# EAGLE design HV Board r2 (EAGLE 7.2.0)
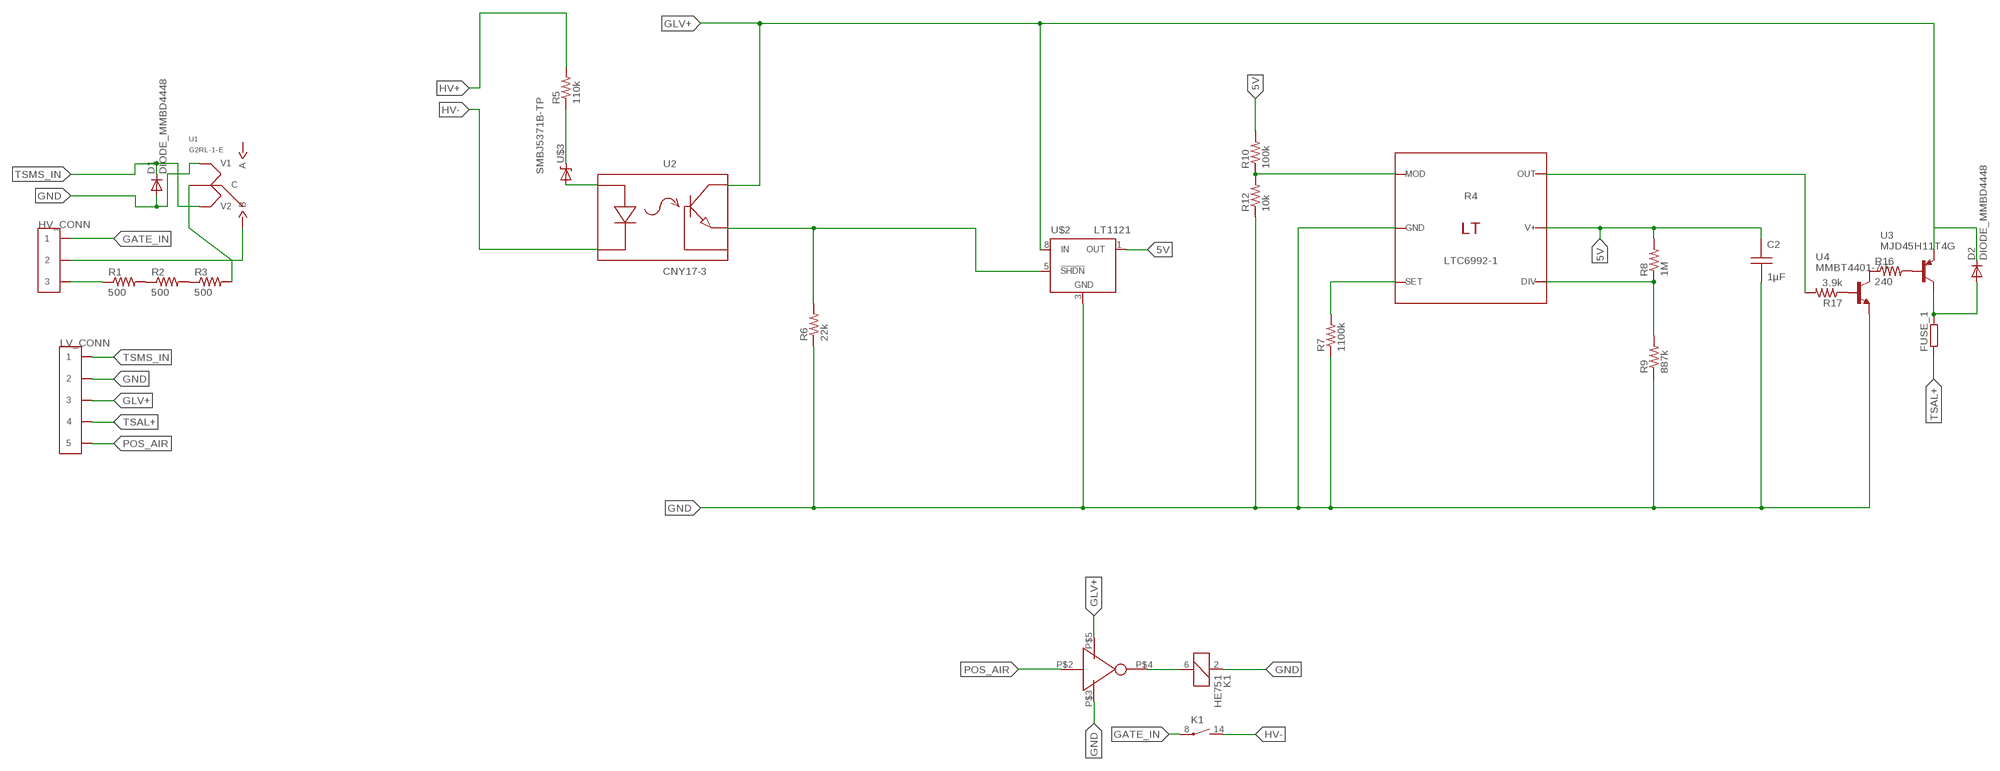
[diagram p0: schematic, sheet 1]

## Parts
C2  1µF  CAP  [C0805]
D1  DIODE_MMBD4448  [SOT-23-3]
D2  DIODE_MMBD4448  [SOT-23-3]
FUSE_1  R-EU_R0402  [R0402]
HV_CONN  CONN_3  [CONNECTOR_3]
K1  HE751  [HE751]
LV_CONN  CONN_5  [CONNECTOR_5]
R1  500  FS20SERIES  [VISHAY_FS20W_RES]
R2  500  FS20SERIES  [VISHAY_FS20W_RES]
R3  500  FS20SERIES  [VISHAY_FS20W_RES]
R4  LTC6992-1  [LTC6992-1]
R5  110k  RESISTORPTH-1W  [AXIAL-0.6]
R6  22k  RESISTOR0603-RES  [0603-RES]
R7  1100k  RESISTOR0603-RES  [0603-RES]
R8  1M  RESISTOR0603-RES  [0603-RES]
R9  887k  RESISTOR0603-RES  [0603-RES]
R10  100k  RESISTOR0603-RES  [0603-RES]
R12  10k  RESISTOR0603-RES  [0603-RES]
R16  240  RESISTORPTH-1W  [AXIAL-0.6]
R17  3.9k  R-US_R0402  [R0402]
U1  G2RL-1-E  [G2RL-1-E_RELAY]
U2  CNY17-3  [CNY17-3]
U3  MJD45H11T4G  [D-PAK_TO252AA]
U4  MMBT4401-7-F  [SOT-23-3]
U$1  TC4S69F(TE85L,F)  [SSOP5-P-0.95]
U$2  LT1121  [SOIC8]
U$3  SMBJ5371B-TP  [SMB-DIODE]

## Nets
5V: C2.1(A) R4.P$5(V+) R8.2 R10.2 U$2.1(OUT)
GATE_IN: HV_CONN.1 HV_CONN.2 K1.8(2:P)
GLV+: D2.P$1(C) LV_CONN.5 LV_CONN.6 U2.P$5(C) U3.3(E) U$1.P$5(VCC) U$2.8(IN)
GND: C2.2(B) D1.P$2(A) K1.2 LV_CONN.3 LV_CONN.4 R4.P$2(GND) R6.1 R7.1 R9.1 R12.1 U1.P$1(V1) U4.P$3(E) U$1.P$3(GND) U$2.3(GND)
HV+: HV_CONN.3 HV_CONN.4 R5.P$2 U1.P$2(B) U1.P$7(B)
HV-: HV_CONN.5 HV_CONN.6 K1.14(2:S) R1.P$1 U2.P$1(K)
N$1: R5.P$1 U$3.C
N$2: K1.6 U$1.P$4(OUT)
N$3: R3.P$2 U1.P$3(C) U1.P$6(C)
N$10: R1.P$2 R2.P$1
N$11: R2.P$2 R3.P$1
N$14: R4.P$1(MOD) R10.1 R12.2
N$15: U2.P$2(A) U$3.A
N$17: R16.P$2 U3.1(B)
N$18: R4.P$3(SET) R7.2
N$19: R4.P$4(DIV) R8.1 R9.2
N$20: R16.P$1 U4.P$1(C)
N$21: R17.1 U4.P$2(B)
N$22: R4.P$6(OUT) R17.2
N$26: R6.2 U2.P$4(E) U$2.5(!SHDN)
N$29: D2.P$2(A) FUSE_1.2 U3.4(C)
POS_AIR: LV_CONN.9 LV_CONN.10 U$1.P$2(IN)
TSAL+: FUSE_1.1 LV_CONN.7 LV_CONN.8
TSMS_IN: D1.P$1(C) LV_CONN.1 LV_CONN.2 U1.P$8(V2)
Unconnected: U1.P$4(A) U1.P$5(A) U2.P$6(B)

## Library data of the parts
C2 = sym:CAP: Capacitor
D1 D2 = formula electric:DIODE_MMBD4448
FUSE_1 = resistor:R-EU_: RESISTOR, European symbol
HV_CONN = formula electric:CONN_3
K1 = relay:HE751: RELAY reed, 1 x norm. open, Hamlin; OC_FARNELL: unknown; OC_NEWARK: unknown
LV_CONN = formula electric:CONN_5
R1-R3 = formula electric:FS20SERIES: Digikey FS20-{R}
R4 = FE_Kenny:LTC6992-1
R5-R10 R12 R16 = SparkFun-Resistors:RESISTOR: Resistor Basic schematic elements and footprints for 0603, 1206, and PTH resistors.
R17 = resistor:R-US_: RESISTOR, American symbol
U1 = formula electric:G2RL-1-E: G2RL-1-E SPDT Relay, 16A, Digikey: Z2834-ND; COIL: DC 12
U2 = FE_Kenny:CNY17-3
U3 = on-semiconductor:MJD45H11T4G
U4 = formula electric:MMBT4401-7-F
U$1 = formula electric:TC4S69F(TE85L,F)
U$2 = linear-technology:LT1121
U$3 = micro-commercial:SMBJ5371B-TP

## Board
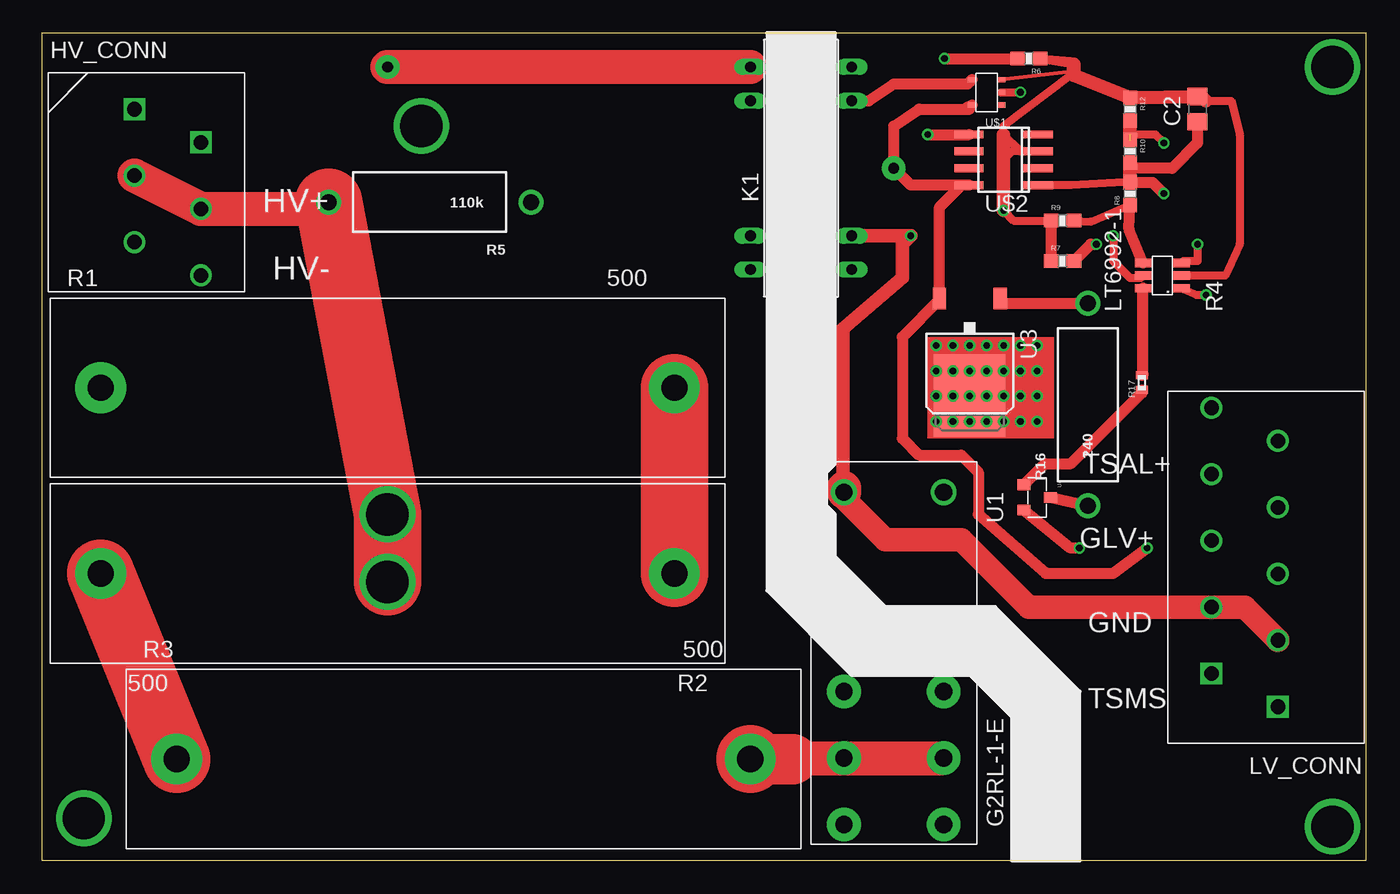
[diagram p1: board, top side]
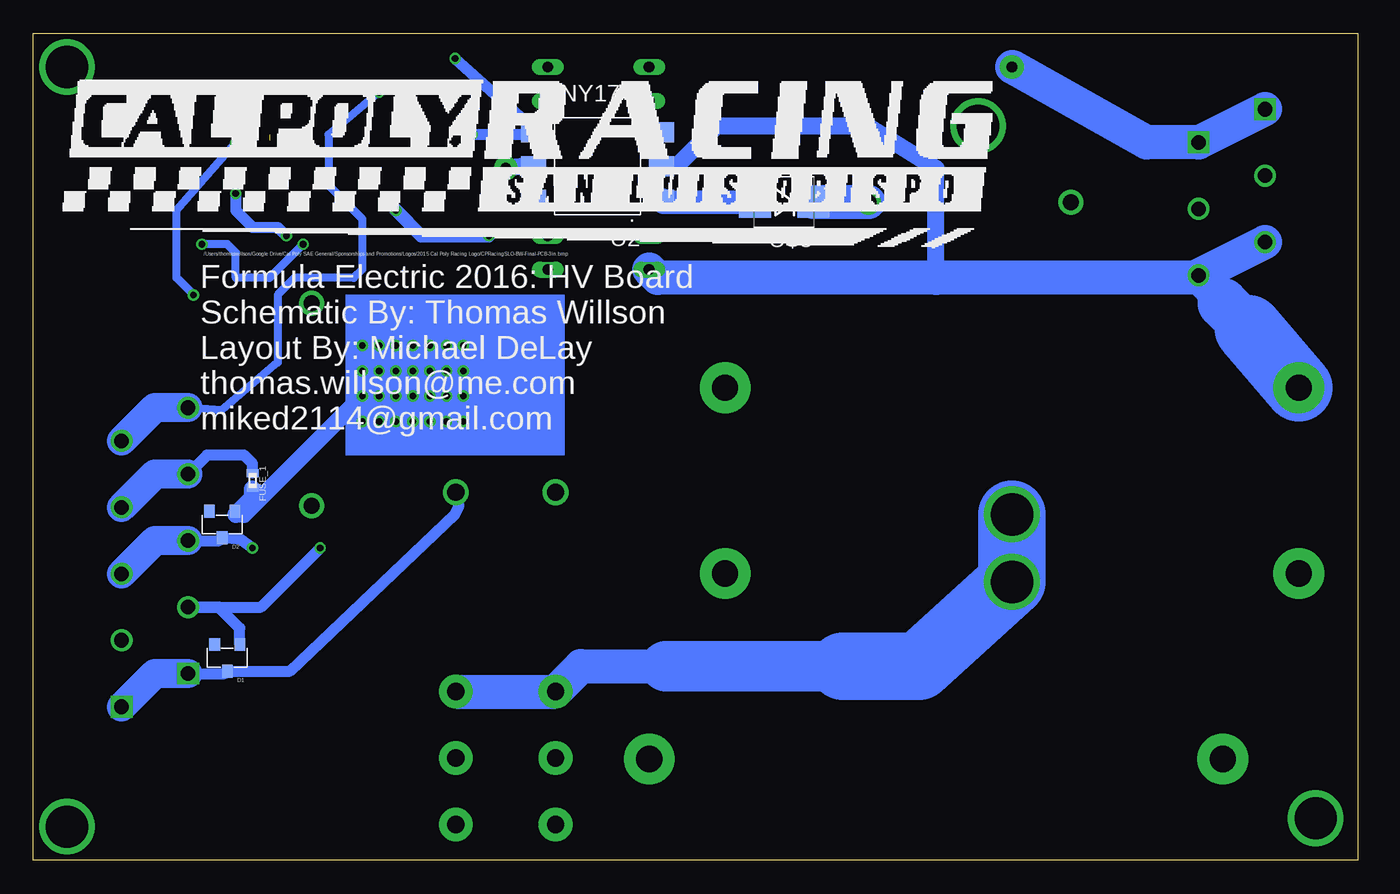
[diagram p2: board, bottom side, seen from below]

Size 99.69 x 62.23 mm. Coordinates in mm from the lower left corner, seen from the top.
Outline: 0,0 99.69,0 99.69,62.23 0,62.23 0,0
Copper layers (1*16): Top 0.0356mm / dielectric 1.5011mm / Bottom 0.0356mm
Design rules "LaenPCBOrder": minimum track width 6mil, minimum drill 13mil, track to track 6mil, track to pad 6mil, pad to pad 6mil, via to via 6mil, smd to smd 6mil, copper to edge 15mil, drill to drill 6mil, minimum pad ring 7mil, minimum via ring 7mil, stop-mask expansion 3mil, vias tented up to drill 0mil, thermal gap 10mil

### Footprints (pad centres in the part's own frame; a part is rotated, then mirrored left to right if it is on the bottom)
C0805 = smd 1.3 x 1.5: 1 -0.95,0; 2 0.95,0
SOT-23-3 = smd 0.8 x 0.976: P$1 0,1; P$2 -0.95,-1; P$3 0.95,-1
R0402 = smd 0.6 x 0.9: 1 -0.55,0; 2 0.55,0
CONNECTOR_3 = drill 1.1 square: 1 0,0; 2 2.5,5 | drill 1.1: 3 5,0; 4 7.5,5; 5 10,0; 6 12.5,5
HE751 = drill 0.813 long: 1 -7.62,-3.81; 2 -5.08,-3.81; 6 5.08,-3.81; 7 7.62,-3.81; 8 7.62,3.81; 9 5.08,3.81; 13 -5.08,3.81; 14 -7.62,3.81
CONNECTOR_5 = drill 1.1 square: 1 0,0; 2 2.5,5 | drill 1.1: 3 5,0; 4 7.5,5; 5 10,0; 6 12.5,5; 7 15,0; 8 17.5,5; 9 20,0; 10 22.5,5
VISHAY_FS20W_RES = drill 1.981 pad 3.81: P$1 -21.59,0; P$2 21.59,0
LTC6992-1 = smd 0.62 x 1.22: P$1 0.5,-0.7; P$2 1.45,-0.7; P$3 2.4,-0.7; P$4 2.4,2.2; P$5 1.45,2.2; P$6 0.5,2.2
AXIAL-0.6 = drill 1.2 pad 1.88: P$1 -7.62,0; P$2 7.62,0
0603-RES = smd 1.1 x 1: 1 -0.85,0; 2 0.85,0
G2RL-1-E_RELAY = drill 1.3: P$1 -15,-3.75; P$8 -15,3.75 | drill 1.3 pad 2.54: P$2 0,-3.75; P$3 5,-3.75; P$4 10,-3.75; P$5 10,3.75; P$6 5,3.75; P$7 0,3.75
CNY17-3 = smd 1.88 x 1.52: P$1 -1.55,3.65; P$2 -1.55,6.19; P$3 -1.55,1.11; P$4 8.05,1.11; P$5 8.05,3.65; P$6 8.05,6.19
D-PAK_TO252AA = smd 1 x 1.6: 1 -2.28,-4.8; 3 2.28,-4.8 | smd 5.4 x 6.2: 4 0,2.5
SSOP5-P-0.95 = smd 0.6 x 0.4: P$1 -1.1,0.95; P$2 -1.1,0; P$3 -1.1,-0.95; P$4 1.1,-0.95; P$5 1.1,0.95
SOIC8 = smd 0.6 x 2.2: 1 -1.905,-2.6; 2 -0.635,-2.6; 3 0.635,-2.6; 4 1.905,-2.6; 5 1.905,2.6; 6 0.635,2.6; 7 -0.635,2.6; 8 -1.905,2.6
SMB-DIODE = smd 2.4 x 2.4: A 2.2,0; C -2.2,0

### Placement (x,y rotation side)
C2  87,56.52 90 top
D1  85.09,15.24 180 bottom
D2  85.47,25.27 180 bottom
FUSE_1  83.19,28.57 270 bottom
HV_CONN  6.99,56.52 270 top
K1  57.15,52.07 90 top
LV_CONN  93.04,11.56 90 top
R1  26.04,35.56 0 top
R2  26.04,21.59 180 top
R3  31.75,7.62 0 top
R4  85.09,42.55 90 top
R5  29.21,49.53 180 top
R6  74.3,60.33 180 top
R7  76.83,45.09 0 top
R8  81.92,50.16 90 top
R9  76.83,48.13 0 top
R10  81.92,53.34 270 top
R12  81.92,56.52 270 top
R16  78.74,34.29 90 top
R17  82.8,35.94 90 top
U1  64.14,12.7 270 top
U2  53.98,55.88 180 bottom
U3  69.85,37.47 180 top
U4  74.93,27.3 270 top
U$1  71.12,57.78 180 top
U$2  72.39,52.7 90 top
U$3  43.18,49.53 180 bottom

### Tracks (layer width: path | path; a pad name or v marks a point on that pad's centre or on a via)
5V  (via drill 0.5)
  Top 0.61: R8.2 81.5,51.02 77.47,50.8 U$2.1 | v80.64,46.99 80.64,45.09 81.92,43.81 82.71,43.81 R4.P$5
  Top 0.813: C2.1 87,53.98 85.09,52.07 81.92,52.07 | R8.2 83.61,51.02 v84.45,50.16
  Top 1.016: R10.2 81.92,52.07 R8.2
  Bottom 0.813: v84.45,50.16 84.45,48.9 83.19,47.62 81.28,47.62 v80.64,46.99
GATE_IN  (via drill 0.8 pad 1.78)
  Top 2.54: v26.04,59.69 K1.8
  Bottom 2.54: HV_CONN.1 HV_CONN.2 15.91,54.02 v26.04,59.69
GLV+  (via drill 0.5, 0.8 pad 1.78)
  Top 0.813: U$1.P$5 69.68,56.69 69.85,56.52 66.04,56.52 64.14,55.24 v64.14,52.07 65.41,50.8 69.22,50.8 | U$2.8 69.22,50.8 | 69.22,50.8 67.57,49.16 U3.3 67.57,42.17 64.77,39.37 64.77,31.75 66.04,30.48 69.22,30.48 70.48,29.21 70.48,26.04 75.56,21.59 80.64,21.59 v83.19,23.5
  Bottom 0.813: LV_CONN.6 85.69,24.06 D2.P$1 84.06,24.13 v83.19,23.5
  Bottom 1.27: U2.P$5 62.7,52.23 v64.14,52.07
  Bottom 2.184: LV_CONN.6 90.54,24.06 LV_CONN.5
GND  (via drill 0.5)
  Top 0.305: 77.47,59.05 77.78,59.37 U$1.P$3
  Top 0.61: 77.47,59.05 72.39,55.24 72.39,54.61 73.66,53.34 U$2.3 73.03,53.34 72.39,52.7 v72.39,48.9 73.15,48.13 R9.1 | 77.47,59.05 77.47,60.11 R6.1 77.69,59.91 77.47,59.05 | 87.63,57.15 89.53,57.15 90.17,54.61 90.17,46.35 89.08,43.99 R4.P$2
  Top 0.813: R7.1 R9.1 | v78.11,23.5 77.42,23.5 U4.P$3
  Top 1.016: 72.39,54.61 v72.39,48.9 | K1.2 v65.41,46.99 64.77,46.35 64.77,43.81 60.33,40.01 60.33,27.94 | 77.69,59.91 77.69,59.05 R12.1 C2.2 87.31,57.47 87.63,57.15
  Top 1.778: U1.P$1 60.38,27.25 63.5,24.13 69.22,24.13 74.3,19.05 86.77,19.05 LV_CONN.4 90.54,19.06 LV_CONN.3
  Top 2.54: 60.33,27.94 60.38,28 U1.P$1
  Bottom 0.813: D1.P$2 84.14,17.46 85.72,19.05 LV_CONN.4 82.54,19.06 v78.11,23.5
  Bottom 1.016: v72.39,48.9 70.48,46.99 v65.41,46.99
HV+  (via drill 3.2 pad 3.81)
  Top 2.54: HV_CONN.3 HV_CONN.4 21.71,49.02 R5.P$2
  Top 5.08: 26.04,20.95 v26.04,26.04 R5.P$2
  Bottom 2.54: U1.P$7 U1.P$2 58.48,14.61 52.07,14.61
  Bottom 3.81: 52.07,14.61 38.73,14.61
  Bottom 5.08: 38.73,14.61 33.02,14.61 26.04,20.95 v26.04,26.04
HV-
  Bottom 1.27: 31.75,43.81 31.75,52.07 36.83,55.24 48.26,55.24 51.27,52.23 U2.P$1
  Bottom 2.54: HV_CONN.5 HV_CONN.6 | HV_CONN.6 10.16,41.91 | HV_CONN.6 12.19,43.81 31.75,43.81 52.7,43.81 K1.14
  Bottom 3.81: 10.16,41.91 8.26,40.01
  Bottom 5.08: 8.26,40.01 R1.P$1
N$1
  Bottom 2.54: R5.P$1 U$3.C
N$2
  Top 0.813: K1.6 62.23,57.15 64.14,58.42 69.7,58.42 U$1.P$4
N$3
  Top 2.54: 56.52,7.62 56.59,7.7 U1.P$3 U1.P$6
  Top 3.81: R3.P$2 56.52,7.62
N$4  (via drill 3.17)
  other vias: 28.58,55.24
N$5  (via drill 3.17)
  other vias: 3.17,3.17
N$6  (via drill 3.2 pad 3.81)
  other vias: 26.04,20.95
N$7  (via drill 0.5)
  other vias: 69.85,34.92
N$8  (via drill 0.5)
  other vias: 73.66,33.02
N$9  (via drill 0.5)
  other vias: 74.93,33.02
N$10
  Top 5.08: R1.P$2 R2.P$1
N$11
  Top 5.08: R2.P$2 R3.P$1
N$12  (via drill 3.17)
  other vias: 97.16,2.54
N$13  (via drill 3.17)
  other vias: 97.16,59.69
N$14  (via drill 0.5)  (1 unrouted)
  Top 0.61: R4.P$1 86.92,42.55 v87.63,42.55 | v84.45,53.98 83.82,54.61 81.92,54.61
  Top 1.016: R12.2 81.92,54.61 R10.1
  Bottom 0.61: v87.63,42.55 88.9,43.81 88.9,48.9 v84.45,53.98
N$15
  Bottom 1.778: U$3.A 52.27,49.53 U2.P$2
N$16  (via drill 0.5)
  other vias: 74.93,36.83
N$17
  Top 0.813: U3.1 72.48,41.91 R16.P$2
N$18  (via drill 0.5)
  Top 0.61: v87,46.35 87,45.09 85.93,45.09 R4.P$3
  Top 0.813: R7.2 78.95,46.35 v79.38,46.35
  Bottom 0.61: v79.38,46.35 81.92,43.81 84.45,43.81 84.45,45.72 85.09,46.35 v87,46.35
N$19
  Top 0.61: R9.2 78.95,48.05 R8.1
  Top 0.813: R4.P$4 81.84,47.48 R8.1
N$20
  Top 0.813: U4.P$1 R16.P$1
N$21
  Top 0.813: U4.P$2 75.52,29.84 77.47,29.84 82.8,35.18 R17.1
N$22
  Top 0.813: R17.2 arc90 82.89,36.58 R4.P$6
N$23  (via drill 0.5)
  other vias: 73.66,36.83
N$24  (via drill 0.5)
  other vias: 72.39,33.02
N$25  (via drill 0.5)
  other vias: 72.39,36.83
N$26  (via drill 0.5)
  Top 0.813: v67.94,60.33 R6.2 | v66.67,54.61 U$2.5
  Bottom 0.813: U2.P$4 62.02,55.04 v67.94,60.33 61.59,54.61 v66.67,54.61
N$27  (via drill 0.5)
  other vias: 71.12,36.83
N$28  (via drill 0.5)
  other vias: 69.85,36.83
N$29  (via drill 0.5)
  Top 1.27: U3.4 71.72,36.83 71.75,36.83 71.12,37.47 68.58,37.47 69.85,36.2 U3.4 | U3.4 71.12,33.7 71.12,33.66 69.85,34.92 U3.4
  Bottom 0.406: FUSE_1.2 83.19,27.94 83.19,27.61 D2.P$2
  Bottom 0.61: FUSE_1.2 83.1,27.94 81.92,27.94 v74.93,34.92 74.89,34.97 U3.4
  Bottom 1.27: U3.4 69.89,34.92 v71.12,34.92 v72.39,34.92 v73.66,34.92 v74.93,34.92 83.82,26.04 84.45,26.04 83.19,27.3 83.19,27.94
N$30  (via drill 0.5)
  other vias: 68.58,36.83
N$31  (via drill 0.5)
  other vias: 68.58,34.92
N$32  (via drill 0.5)
  other vias: 67.31,36.83
N$33  (via drill 0.5)
  other vias: 67.31,34.92
N$34  (via drill 0.5)
  other vias: 67.31,33.02
N$35  (via drill 0.5)
  other vias: 68.58,33.02
N$36  (via drill 0.5)
  other vias: 69.85,33.02
N$37  (via drill 0.5)
  other vias: 71.12,33.02
N$38  (via drill 0.5)
  other vias: 67.31,38.73
N$39  (via drill 0.5)
  other vias: 68.58,38.73
N$40  (via drill 0.5)
  other vias: 69.85,38.73
N$41  (via drill 0.5)
  other vias: 71.12,38.73
N$42  (via drill 0.5)
  other vias: 72.39,38.73
N$43  (via drill 0.5)
  other vias: 73.66,38.73
N$44  (via drill 0.5)
  other vias: 74.93,38.73
POS_AIR  (via drill 0.5)
  Top 0.61: U$1.P$2 v73.66,57.78
  Bottom 0.61: v73.66,57.78 77.47,54.61 77.47,50.8 74.93,48.26 74.93,44.45 75.56,43.81 80.01,43.81 81.28,42.55 81.28,37.47 85.5,33.88 LV_CONN.10
  Bottom 2.184: LV_CONN.10 90.54,34.06 LV_CONN.9
TSAL+
  Bottom 0.813: FUSE_1.1 83.19,29.84 83.82,30.48 86.62,30.48 LV_CONN.8
  Bottom 2.184: LV_CONN.8 90.54,29.06 LV_CONN.7
TSMS_IN
  Bottom 0.813: LV_CONN.2 85.27,14.06 D1.P$1 80.38,14.24 67.94,26.04 67.64,26.67 U1.P$8
  Bottom 2.184: LV_CONN.2 90.54,14.06 LV_CONN.1
(copper drawn outside any net)
  shapes: Bottom area x2, Top area x4, Top circle x1

### Text on the board
tPlace: HV+ | HV- | TSAL+ | GLV+ | GND | TSMS
bPlace: /Users/thomaswillson/Google Drive/Cal Poly SAE General/Sponsorships and Promotions/Logos/2015 Cal Poly Racing Logo/CPRacingSLO-BW-Final-PCB-3in.bmp
bNames: Formula Electric 2016: HV Board / Schematic By: Thomas Willson / Layout By: Michael DeLay / thomas.willson@me.com / miked2114@gmail.com